# EAGLE design piston_stm (EAGLE 8.6.1)
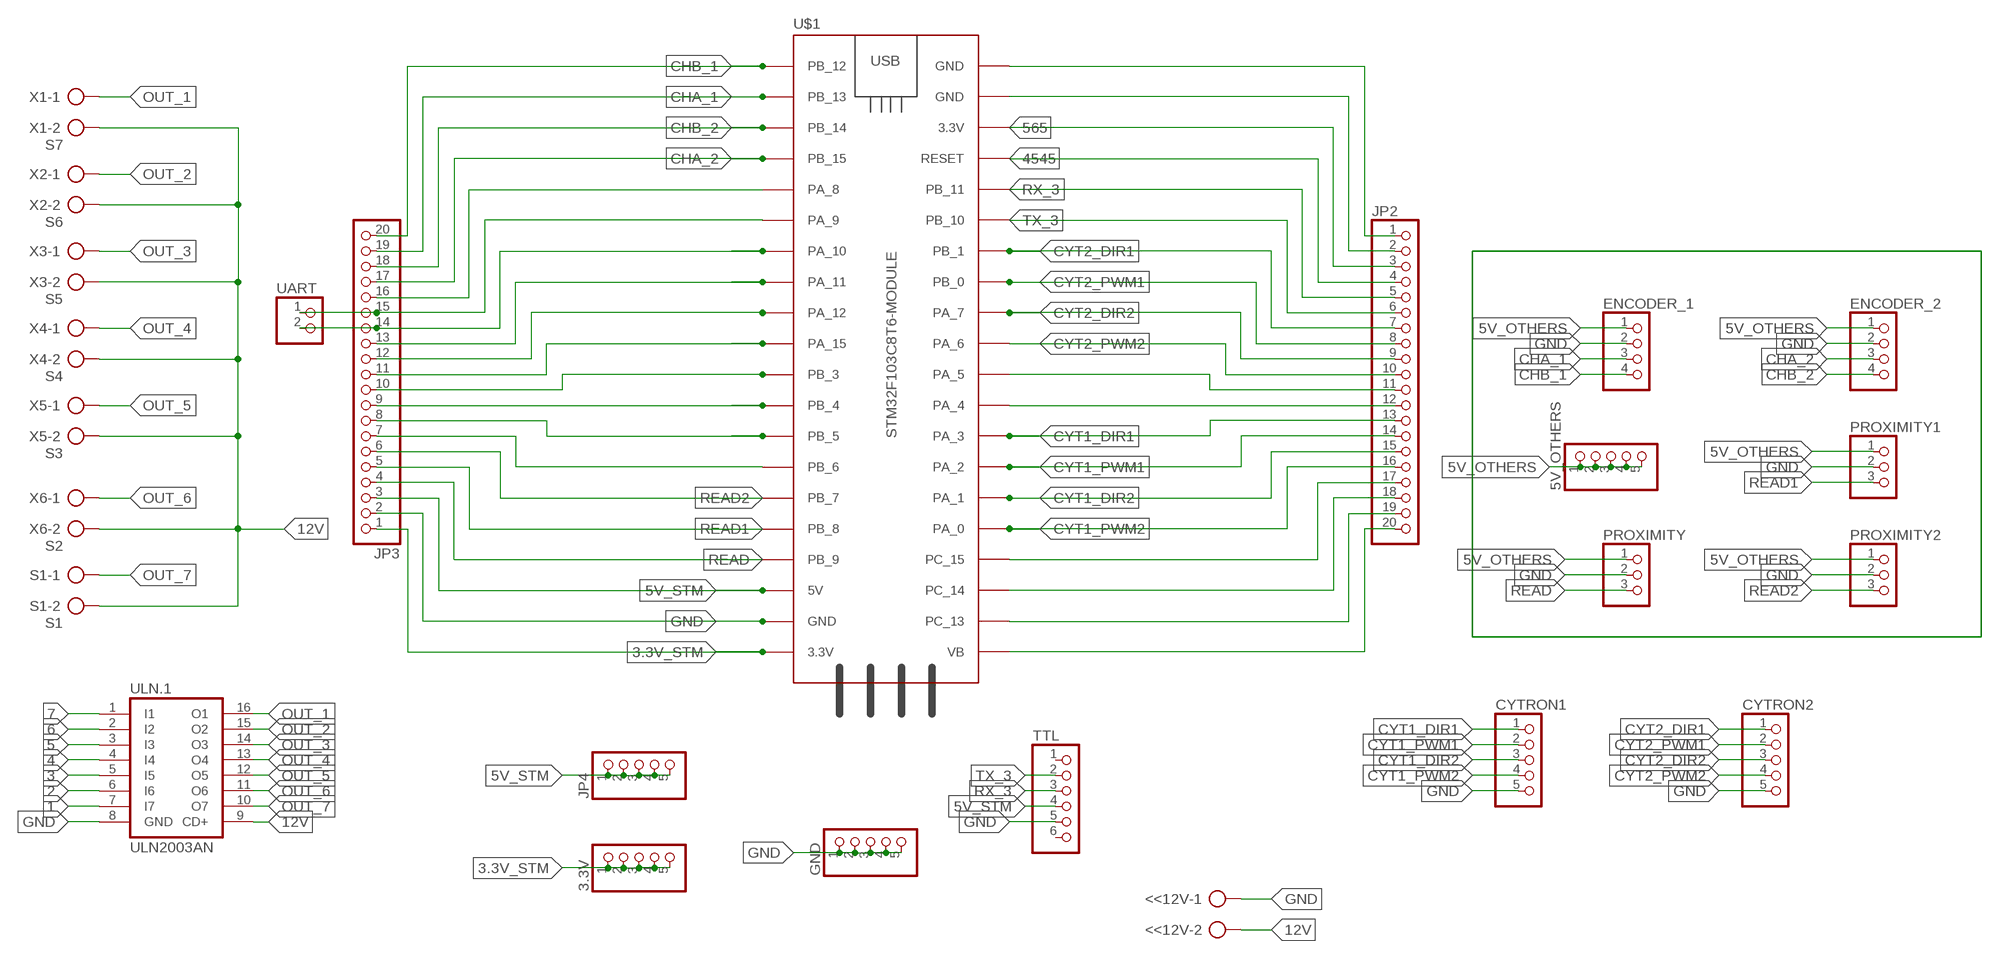
[diagram p0: schematic, sheet 1]

## Parts
3.3V  PINHD-1X5  [1X05]
5V_OTHERS  PINHD-1X5  [1X05]
<<12V  AK300/2  [AK300/2]
CYTRON1  PINHD-5_DATA  [DATA_5]
CYTRON2  PINHD-5_DATA  [DATA_5]
ENCODER_1  PINHD-4_DATA  [DATA_4]
ENCODER_2  PINHD-4_DATA  [DATA_4]
GND  PINHD-1X5  [1X05]
JP2  PINHD-1X20  [1X20]
JP3  PINHD-1X20  [1X20]
JP4  PINHD-1X5  [1X05]
PROXIMITY  PINHD-3_DATA  [DATA_3]
PROXIMITY1  PINHD-3_DATA  [DATA_3]
PROXIMITY2  PINHD-3_DATA  [DATA_3]
S1  S1  AK300/2  [AK300/2]
TTL  PINHD-6_DATA  [DATA_6]
U$1  STM32F103C8T6-MODULE  [STM32F103C8T6-MODULE]
UART  PINHD-2_DATA  [DATA_2]
ULN.1  ULN2003AN  [DIL16]
X1  S7  AK300/2  [AK300/2]
X2  S6  AK300/2  [AK300/2]
X3  S5  AK300/2  [AK300/2]
X4  S4  AK300/2  [AK300/2]
X5  S3  AK300/2  [AK300/2]
X6  S2  AK300/2  [AK300/2]

## Nets
0: JP3.7 U$1.PB_6
1: JP3.13 U$1.PA_11 ULN.1.7(I7)
2: JP3.12 U$1.PA_12 ULN.1.6(I6)
3: JP3.11 U$1.PA_15 ULN.1.5(I5)
3.3V_STM: 3.3V.1 3.3V.2 3.3V.3 3.3V.4 3.3V.5 JP3.1 U$1.3.3V_1(3.3V)
4: JP3.10 U$1.PB_3 ULN.1.4(I4)
5: JP3.9 U$1.PB_4 ULN.1.3(I3)
5V_OTHERS: 5V_OTHERS.1 5V_OTHERS.2 5V_OTHERS.3 5V_OTHERS.4 5V_OTHERS.5 ENCODER_1.1 ENCODER_2.1 PROXIMITY1.1 PROXIMITY2.1 PROXIMITY.1
5V_STM: JP3.3 JP4.1 JP4.2 JP4.3 JP4.4 JP4.5 TTL.4 U$1.5V
6: JP3.8 U$1.PB_5 ULN.1.2(I2)
7: JP2.12 U$1.PA_4 ULN.1.1(I1)
12V: <<12V.2 S1.2 ULN.1.9(CD+) X1.2 X2.2 X3.2 X4.2 X5.2 X6.2
565: JP2.3 U$1.3.3V_2(3.3V)
4545: JP2.4 U$1.RESET
54454: JP3.14 U$1.PA_10 UART.2
CHA_1: ENCODER_1.3 JP3.19 U$1.PB_13
CHA_2: ENCODER_2.3 JP3.17 U$1.PB_15
CHB_1: ENCODER_1.4 JP3.20 U$1.PB_12
CHB_2: ENCODER_2.4 JP3.18 U$1.PB_14
CYT1_DIR1: CYTRON1.1 JP2.13 U$1.PA_3
CYT1_DIR2: CYTRON1.3 JP2.15 U$1.PA_1
CYT1_PWM1: CYTRON1.2 JP2.14 U$1.PA_2
CYT1_PWM2: CYTRON1.4 JP2.16 U$1.PA_0
CYT2_DIR1: CYTRON2.1 JP2.7 U$1.PB_1
CYT2_DIR2: CYTRON2.3 JP2.9 U$1.PA_7
CYT2_PWM1: CYTRON2.2 JP2.8 U$1.PB_0
CYT2_PWM2: CYTRON2.4 JP2.10 U$1.PA_6
GND: <<12V.1 CYTRON1.5 CYTRON2.5 ENCODER_1.2 ENCODER_2.2 GND.1 GND.2 GND.3 GND.4 GND.5 JP2.1 JP2.2 JP3.2 PROXIMITY1.2 PROXIMITY2.2 PROXIMITY.2 TTL.5 U$1.GND_1(GND) U$1.GND_2(GND) U$1.GND_3(GND) ULN.1.8(GND)
N$11: JP2.11 U$1.PA_5
N$14: JP2.20 U$1.VB
N$15: JP2.19 U$1.PC_13
N$16: JP2.18 U$1.PC_14
N$17: JP2.17 U$1.PC_15
N$23: JP3.16 U$1.PA_8
N$24: JP3.15 U$1.PA_9 UART.1
OUT_1: ULN.1.16(O1) X1.1
OUT_2: ULN.1.15(O2) X2.1
OUT_3: ULN.1.14(O3) X3.1
OUT_4: ULN.1.13(O4) X4.1
OUT_5: ULN.1.12(O5) X5.1
OUT_6: ULN.1.11(O6) X6.1
OUT_7: S1.1 ULN.1.10(O7)
READ: JP3.4 PROXIMITY.3 U$1.PB_9
READ1: JP3.5 PROXIMITY1.3 U$1.PB_8
READ2: JP3.6 PROXIMITY2.3 U$1.PB_7
RX_3: JP2.5 TTL.3 U$1.PB_11
TX_3: JP2.6 TTL.2 U$1.PB_10
Unconnected: TTL.1 TTL.6

## Library data of the parts
3.3V 5V_OTHERS GND JP4 = MIA_LIBRARY:PINHD-1X5: PIN HEADER
<<12V S1 X1-X6 = con-ptr500:AK300/2: CONNECTOR; OC_FARNELL: unknown; OC_NEWARK: unknown
CYTRON1 CYTRON2 = MIA_LIBRARY:PINHD-5_DATA: PIN HEADER
ENCODER_1 ENCODER_2 = MIA_LIBRARY:PINHD-4_DATA: PIN HEADER
JP2 JP3 = pinhead:PINHD-1X20: PIN HEADER
PROXIMITY PROXIMITY1 PROXIMITY2 = MIA_LIBRARY:PINHD-3_DATA: PIN HEADER
TTL = MIA_LIBRARY:PINHD-6_DATA: PIN HEADER
U$1 = MIA_LIBRARY:STM32F103C8T6-MODULE: STM32F103C8T6 module with ARM Cortex-3, 20kB SRAM, 64kB Flash, 72MHz
UART = MIA_LIBRARY:PINHD-2_DATA: PIN HEADER
ULN.1 = MIA_LIBRARY:ULN2003A: DRIVER ARRAY

## Board
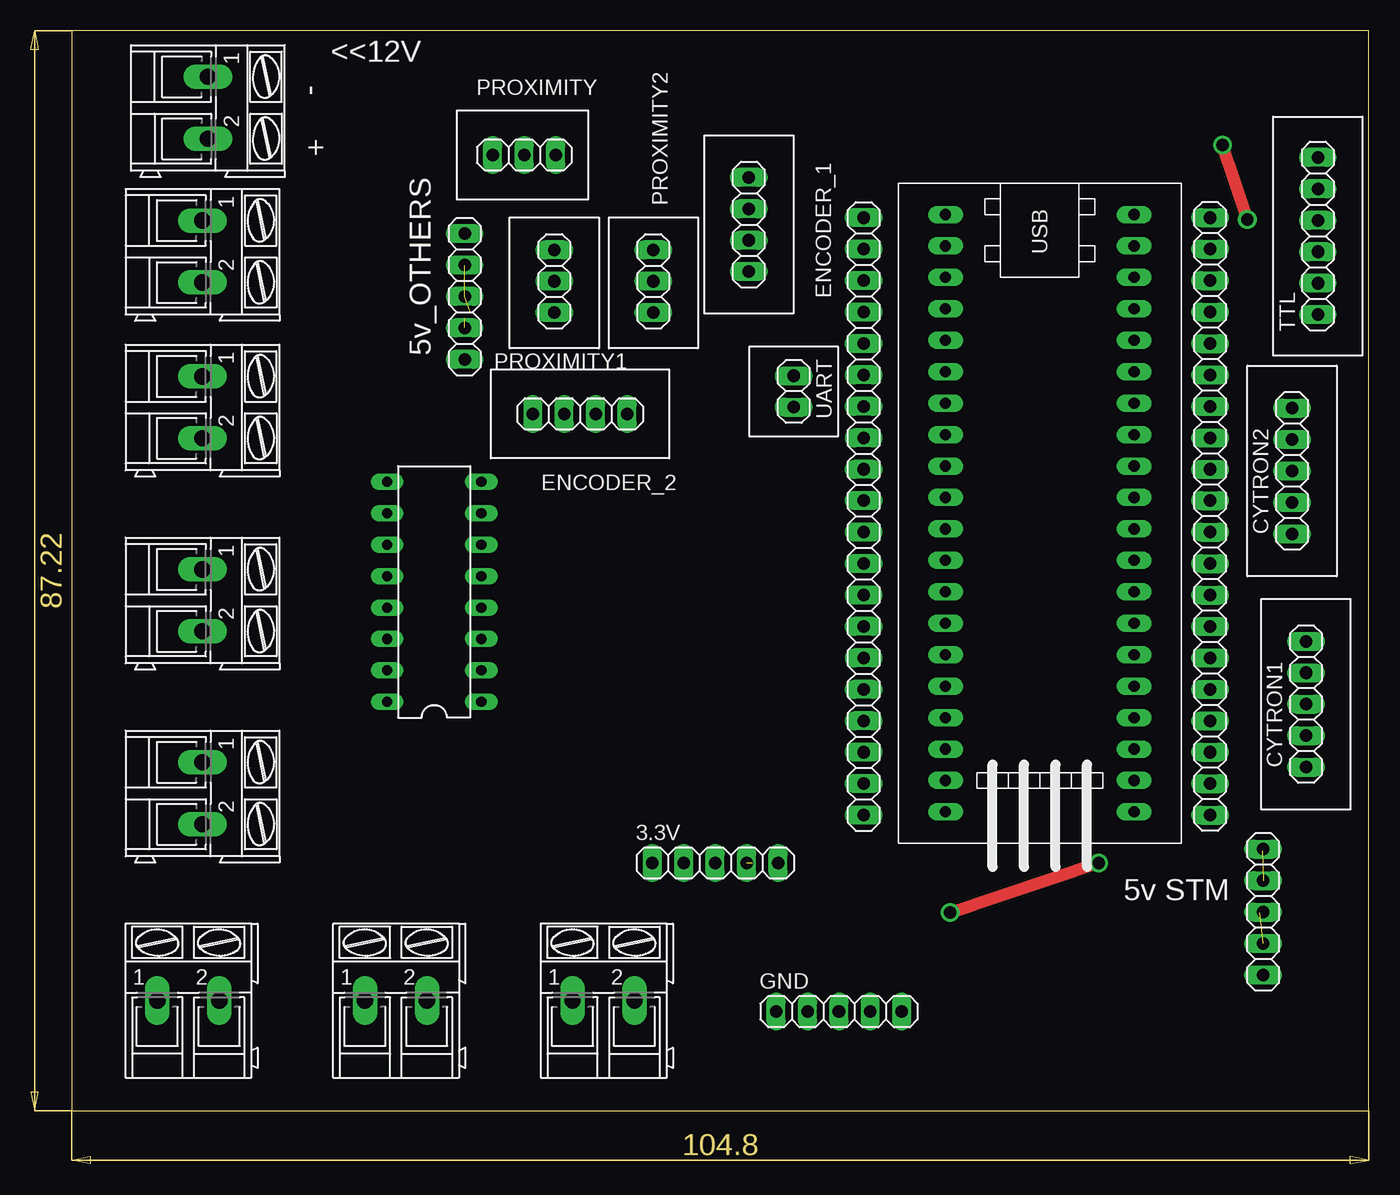
[diagram p1: board, top side]
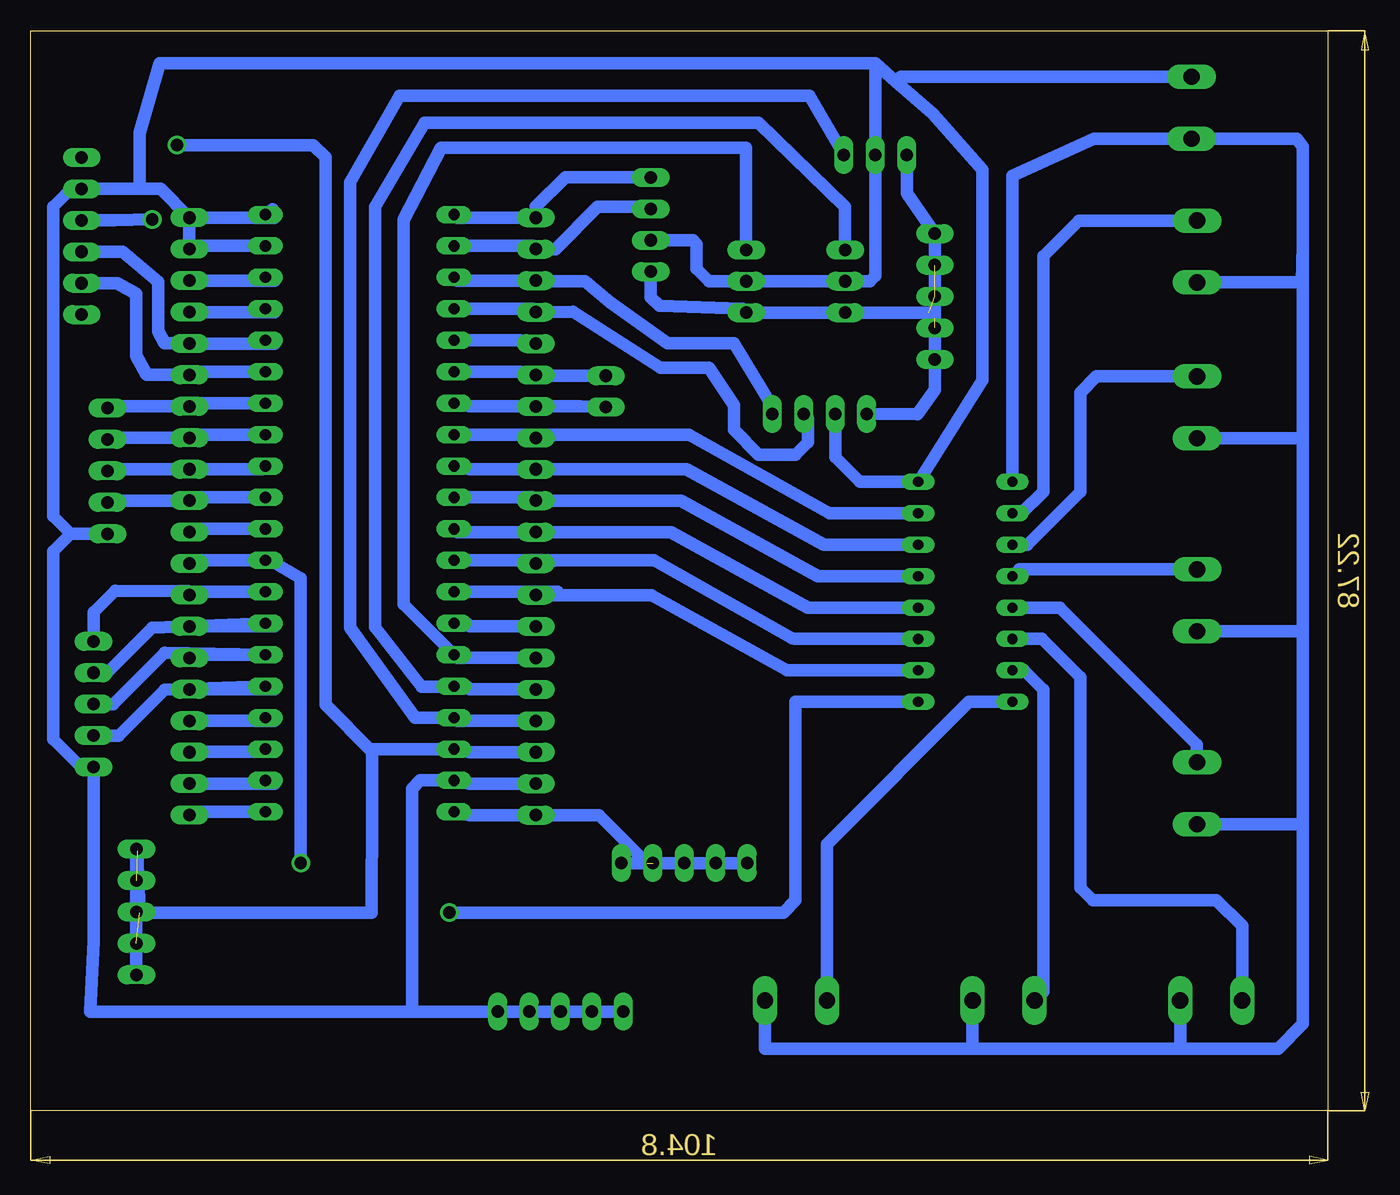
[diagram p2: board, bottom side, seen from below]

Size 104.8 x 87.22 mm. Coordinates in mm from the lower left corner, seen from the top.
Outline: 0,0 104.8,0 104.8,87.22 0,87.22 0,0
Copper layers (1*16): Top 0.035mm / dielectric 1.5mm / Bottom 0.035mm
Design rules "default": minimum track width 6mil, minimum drill 0.35mm, track to track 6mil, track to pad 6mil, pad to pad 6mil, via to via 6mil, smd to smd 6mil, copper to edge 40mil, drill to drill 6mil, minimum pad ring 10mil, minimum via ring 8mil, stop-mask expansion 4mil, vias tented up to drill 0mil, thermal gap 10mil

### Footprints (pad centres in the part's own frame; a part is rotated, then mirrored left to right if it is on the bottom)
1X05 = drill 1.016 long: 1 -5.08,0; 2 -2.54,0; 3 0,0; 4 2.54,0; 5 5.08,0
AK300/2 = drill 1.321 long: 1 -2.515,0; 2 2.489,0
DATA_5 = drill 1.016 long: 1 -5.08,0; 2 -2.54,0; 3 0,0; 4 2.54,0; 5 5.08,0
DATA_4 = drill 1.016 long: 1 -3.81,0; 2 -1.27,0; 3 1.27,0; 4 3.81,0
1X20 = drill 1.016 long: 1 -24.13,0; 2 -21.59,0; 3 -19.05,0; 4 -16.51,0; 5 -13.97,0; 6 -11.43,0; 7 -8.89,0; 8 -6.35,0; 9 -3.81,0; 10 -1.27,0; 11 1.27,0; 12 3.81,0; 13 6.35,0; 14 8.89,0; 15 11.43,0; 16 13.97,0; 17 16.51,0; 18 19.05,0; 19 21.59,0; 20 24.13,0
DATA_3 = drill 1.016 long: 1 -2.54,0; 2 0,0; 3 2.54,0
DATA_6 = drill 1.016 long: 1 -6.35,0; 2 -3.81,0; 3 -1.27,0; 4 1.27,0; 5 3.81,0; 6 6.35,0
STM32F103C8T6-MODULE = drill 0.9 long: 3.3V_1 25.4,-7.62; 3.3V_2 -17.78,7.62; 5V 20.32,-7.62; GND_1 22.86,-7.62; GND_2 -20.32,7.62; GND_3 -22.86,7.62; PA_0 15.24,7.62; PA_1 12.7,7.62; PA_2 10.16,7.62; PA_3 7.62,7.62; PA_4 5.08,7.62; PA_5 2.54,7.62; PA_6 0,7.62; PA_7 -2.54,7.62; PA_8 -12.7,-7.62; PA_9 -10.16,-7.62; PA_10 -7.62,-7.62; PA_11 -5.08,-7.62; PA_12 -2.54,-7.62; PA_15 0,-7.62; PB_0 -5.08,7.62; PB_1 -7.62,7.62; PB_3 2.54,-7.62; PB_4 5.08,-7.62; PB_5 7.62,-7.62; PB_6 10.16,-7.62; PB_7 12.7,-7.62; PB_8 15.24,-7.62; PB_9 17.78,-7.62; PB_10 -10.16,7.62; PB_11 -12.7,7.62; PB_12 -22.86,-7.62; PB_13 -20.32,-7.62; PB_14 -17.78,-7.62; PB_15 -15.24,-7.62; PC_13 22.86,7.62; PC_14 20.32,7.62; PC_15 17.78,7.62; RESET -15.24,7.62; VB 25.4,7.62
DATA_2 = drill 1.016 long: 1 -1.27,0; 2 1.27,0
DIL16 = drill 0.813 long: 1 -8.89,-3.81; 2 -6.35,-3.81; 3 -3.81,-3.81; 4 -1.27,-3.81; 5 1.27,-3.81; 6 3.81,-3.81; 7 6.35,-3.81; 8 8.89,-3.81; 9 8.89,3.81; 10 6.35,3.81; 11 3.81,3.81; 12 1.27,3.81; 13 -1.27,3.81; 14 -3.81,3.81; 15 -6.35,3.81; 16 -8.89,3.81

### Placement (x,y rotation side)
3.3V  52,20 0 top
5V_OTHERS  31.75,65.77 90 top
<<12V  14.3,85.3 270 top
CYTRON1  99.74,32.83 270 top
CYTRON2  98.62,51.68 270 top
ENCODER_1  54.72,71.58 90 top
ENCODER_2  41.07,56.28 0 top
GND  62,8 0 top
JP2  92,48 270 top
JP3  64,48 90 top
JP4  96.29,16.04 270 top
PROXIMITY  36.56,77.2 0 top
PROXIMITY1  39,67 90 top
PROXIMITY2  47,67 90 top
S1  10.57,69.39 270 top
TTL  100.7,70.65 90 top
U$1  78.23,49.53 270 top
UART  58.34,58.09 270 top
ULN.1  29.29,41.91 90 top
X1  42.99,8.89 0 top
X2  26.21,8.89 0 top
X3  9.43,8.89 0 top
X4  10.57,25.62 270 top
X5  10.57,41.21 270 top
X6  10.57,56.8 270 top

### Tracks (layer width: path | path; a pad name or v marks a point on that pad's centre or on a via)
0
  Bottom 1.016: JP3.7 69.35,39.11 69.61,39.37 U$1.PB_6
1
  Bottom 1.016: U$1.PA_11 62.26,54.61 | 62.26,54.61 JP3.13 | 62.26,54.61 51.61,54.61 40.26,48.26 ULN.1.7
2
  Bottom 1.016: U$1.PA_12 69.35,51.81 JP3.12 51.81,51.81 40.72,45.72 ULN.1.6
3
  Bottom 1.016: U$1.PA_15 64.26,49.53 JP3.11 52.27,49.27 41.18,43.18 ULN.1.5
3.3V_STM  (1 unrouted)
  Bottom 1.016: U$1.3.3V_1 69.35,23.87 JP3.1 58.87,23.87 55,20 3.3V.3 | 3.3V.3 3.3V.1 3.3V.2 3.3V.3 | 3.3V.4 3.3V.5
4
  Bottom 1.016: ULN.1.4 42,40.64 53.09,46.73 JP3.10 70.35,46.73 U$1.PB_3
5
  Bottom 1.016: ULN.1.3 43.1,38.1 43.28,38.14 54.45,44.45 62.26,44.45 | U$1.PB_4 62.26,44.45 | 62.26,44.45 JP3.9
5V_OTHERS  (3 unrouted)
  Bottom 1.016: 31.75,64 5V_OTHERS.1 31.75,58.25 33.18,56.26 ENCODER_2.1 | 31.75,64 5V_OTHERS.5 34.02,74.12 PROXIMITY.1 | ENCODER_1.1 54.72,65.72 54,65 47.31,64.77 PROXIMITY2.1 PROXIMITY1.1 32.21,64.46 31.75,64
5V_STM  (via drill 1)  (2 unrouted)
  Top 1.016: v95,72 v93,78
  Bottom 1.016: 77.23,29 77.23,29.21 U$1.5V 69.35,28.95 JP3.3 | 77.23,29 77.23,24.77 77.27,16 96,16 96.2,21.01 JP4.3 | JP4.5 JP4.3 | JP4.3 JP4.1 | 77.23,29 81,32.77 81,77 82,78 v93,78 | TTL.4 98.08,71.92 v95,72
6
  Bottom 1.016: ULN.1.2 33.56,35.56 43.72,35.56 54.65,41.65 JP3.8 62.26,41.91 U$1.PB_5
7  (via drill 1)
  Top 1.016: v83,20 83.12,20.04 v71,16
  Bottom 1.016: ULN.1.1 43,33.02 43,17 44,16 v71,16 | JP2.12 91.74,44.45 U$1.PA_4 85.45,44.45 83,43 v83,20
12V
  Bottom 1.016: X1.2 45.48,5 29,5 | 29,5 12,5 | 12,5 4,5 2,7 2,23 | 2,23 2,39 | 2,39 2,54 | 2,54 2,70 | 2,70 2,77.88 2.49,78.51 <<12V.2 9.37,78.53 18.88,78.53 25.48,75.52 ULN.1.9 | X2.2 28.7,5.3 29,5 | X3.2 11.92,5.08 12,5 | X4.2 2.13,23.13 2,23 | X5.2 2.28,38.72 2,39 | X6.2 2.31,54.31 2,54 | S1.2 2.1,66.9 2,70
565
  Bottom 1.016: JP2.3 85.11,67.05 U$1.3.3V_2
4545
  Bottom 1.016: JP2.4 85.11,64.51 U$1.RESET
54454
  Bottom 1.016: U$1.PA_10 69.35,56.89 JP3.14 60.41,56.89 UART.2
CHA_1
  Bottom 1.016: U$1.PB_13 64.26,69.85 JP3.19 62.41,69.59 59,73 54.87,73 ENCODER_1.3
CHA_2
  Bottom 1.016: U$1.PB_15 64.26,64.77 JP3.17 61,64.53 53.92,60.02 50,60 48,57 48,55 46,53 43,53 42,54 42,55.94 ENCODER_2.3
CHB_1
  Bottom 1.016: ENCODER_1.4 61.61,75.39 64,73 JP3.20 70.35,72.13 U$1.PB_12
CHB_2
  Bottom 1.016: U$1.PB_14 70.35,67.05 JP3.18 63.95,67 60,67 57.99,65.31 53.36,61.99 48,62 44.88,56.88 ENCODER_2.4
CYT1_DIR1
  Bottom 1.016: CYTRON1.1 99.74,40.26 98,42 U$1.PA_3 91.74,41.91 JP2.13
CYT1_DIR2
  Bottom 1.016: CYTRON1.3 98.17,32.83 94,37 U$1.PA_1 91.74,36.83 JP2.15
CYT1_PWM1
  Bottom 1.016: CYTRON1.2 98.63,35.37 95,39 U$1.PA_2 85.11,39.11 JP2.14
CYT1_PWM2
  Bottom 1.016: CYTRON1.4 97.71,30.29 94,34 U$1.PA_0 85.11,34.03 JP2.16
CYT2_DIR1
  Bottom 1.016: U$1.PB_1 91.74,57.15 JP2.7 98.49,56.89 CYTRON2.1
CYT2_DIR2
  Bottom 1.016: U$1.PA_7 86.11,51.81 JP2.9 98.49,51.81 CYTRON2.3
CYT2_PWM1
  Bottom 1.016: U$1.PB_0 91.74,54.61 JP2.8 98.49,54.35 CYTRON2.2
CYT2_PWM2
  Bottom 1.016: U$1.PA_6 91.74,49.53 JP2.10 98.49,49.27 CYTRON2.4
GND
  Bottom 1.016: 36.56,84.62 94.38,84.62 96,79 96,74.46 | 36.56,84.62 PROXIMITY.2 36.56,67.44 37,67 PROXIMITY1.2 PROXIMITY2.2 50,67 51,68 51,70 51.31,70.31 ENCODER_1.2 | 74,8 74,26 73.33,26.67 U$1.GND_1 69.35,26.41 JP3.2 | 74,8 100,8 99.74,13.74 CYTRON1.5 100.75,27.75 103,30 103,45.19 101.6,46.6 | 34.88,83.14 31.91,80.52 27.9,76 27.9,59 33.02,50.83 32.75,50.82 32.8,50.8 ULN.1.8 37.8,50.8 39.8,52.8 ENCODER_2.2 | 34.88,83.14 36.56,84.62 | JP2.1 85.11,72.13 U$1.GND_3 85.26,72.8 | U$1.GND_2 91.74,69.85 | 91.74,69.85 JP2.2 | JP2.1 92,70.11 91.74,69.85 | JP2.1 94.33,74.46 96,74.46 | 96,74.46 TTL.5 101.54,74.46 103,73 103,48 101.6,46.6 | 101.6,46.6 CYTRON2.5 | 74,8 GND.5 GND.4 GND.3 GND.2 GND.1 | <<12V.1 34.5,83.52 34.88,83.14
N$11
  Bottom 1.016: U$1.PA_5 91.74,46.99 JP2.11
N$14
  Bottom 1.016: U$1.VB 91.74,24.13 JP2.20
N$15
  Bottom 1.016: JP2.19 85.11,26.41 U$1.PC_13
N$16
  Bottom 1.016: U$1.PC_14 85.06,29 92,29 JP2.18
N$17
  Bottom 1.016: JP2.17 85.11,31.49 U$1.PC_15
N$23
  Bottom 1.016: U$1.PA_8 65.26,62.23 JP3.16
N$24
  Bottom 1.016: U$1.PA_9 65.26,59.69 JP3.15 63.93,59.36 UART.1
OUT_1
  Bottom 1.016: ULN.1.16 28.98,33.02 40.48,21.52 X1.1
OUT_2
  Bottom 1.016: ULN.1.15 24.56,35.56 23,34 23,9.59 X2.1
OUT_3
  Bottom 1.016: ULN.1.14 23.1,38.1 20,35 20,18 19,17 9,17 6.92,14.91 X3.1
OUT_4
  Bottom 1.016: ULN.1.13 21.64,40.64 10.57,29.57 X4.1
OUT_5
  Bottom 1.016: X5.1 24.93,43.73 ULN.1.12
OUT_6
  Bottom 1.016: X6.1 18.68,59.31 20,58 20,50 24.28,45.72 ULN.1.11
OUT_7
  Bottom 1.016: S1.1 20.09,71.91 23,69 23,50 24.74,48.26 ULN.1.10
READ
  Bottom 1.016: PROXIMITY.3 41.9,82 75,82 79,75 79,39 73.75,31.75 U$1.PB_9 70.35,31.49 JP3.4
READ1
  Bottom 1.016: PROXIMITY1.3 39,73 46,79.8 73,79.8 77,73 77,39.04 73.21,34.26 70.64,34.26 U$1.PB_8 69.61,34.29 69.35,34.03 JP3.5
READ2
  Bottom 1.016: PROXIMITY2.3 47,77.8 71.63,77.8 74.68,71.95 74.68,40.9 U$1.PB_7 70.35,36.57 JP3.6
RX_3
  Bottom 1.016: U$1.PB_11 85.11,61.97 JP2.5 92.03,62 94,62 94.51,62.97 94.51,66.97 97.38,69.38 TTL.3
TX_3
  Bottom 1.016: U$1.PB_10 91.74,59.69 JP2.6 95.43,59.43 96.28,61 96.28,66 97.84,66.84 TTL.2

### Text on the board
tPlace: - | +
tNames: 5v_OTHERS | 5v STM